# Altium schematic sheet 0215_BBR-0 - RE-TIMER -.SchDoc
size A3
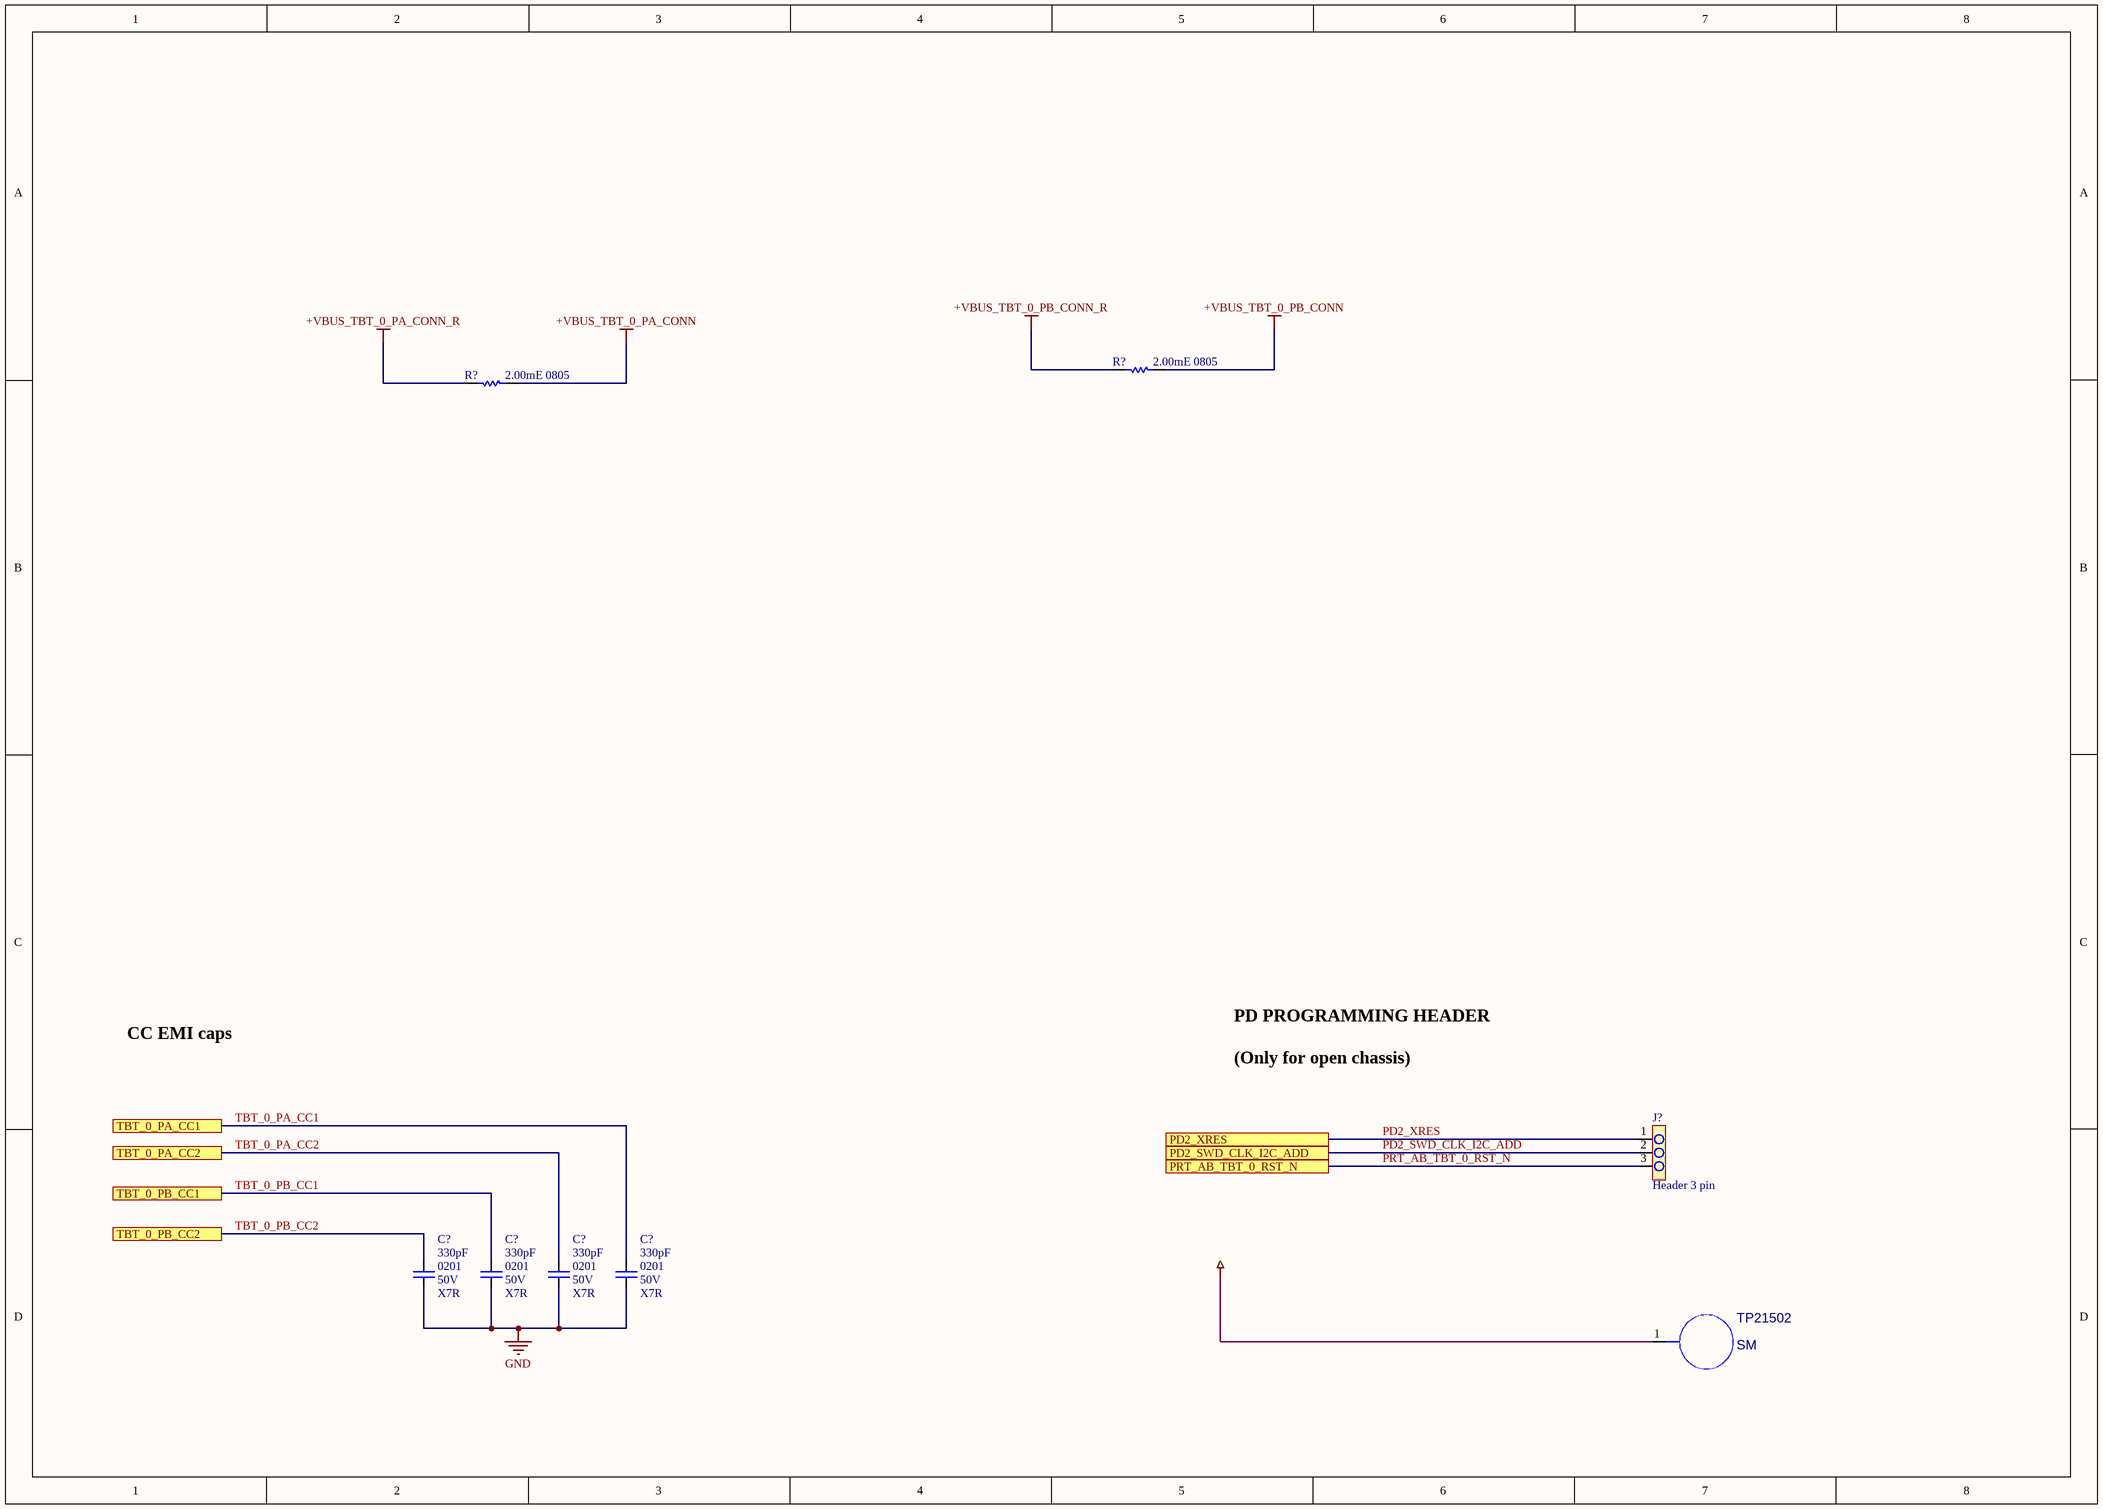
[diagram p0: 0215_BBR-0 - RE-TIMER -.SchDoc]

## Parts
(Parts that share a designator on the sheet are numbered #1, #2 ... from top to bottom, then left to right.)
C?#1  value 330pF  Case/Package: 0201  Voltage: 50V  Dielectric: X7R  [CAPC0201]
C?#2  value 330pF  Case/Package: 0201  Voltage: 50V  Dielectric: X7R  [CAPC0201]
C?#3  value 330pF  Case/Package: 0201  Voltage: 50V  Dielectric: X7R  [CAPC0201]
C?#4  value 330pF  Case/Package: 0201  Voltage: 50V  Dielectric: X7R  [CAPC0201]
J?  Header 3 pin
R?#1  value 2.00mE  Case/Package: 0805  [RESC0805]  (hidden comment: Res)
R?#2  value 2.00mE  Case/Package: 0805  [RESC0805]  (hidden comment: Res)
TP21502  PACK_TYPE: SM  [TPC30IA]  (hidden comment: TP)

## Ports
PD2_SWD_CLK_I2C_ADD, PD2_XRES, PRT_AB_TBT_0_RST_N, TBT_0_PA_CC1, TBT_0_PA_CC2, TBT_0_PB_CC1, TBT_0_PB_CC2

## Nets
+V3P3A_VDDD_PD2: TP21502.1(TP)
+VBUS_TBT_0_PA_CONN: R?#2.2
+VBUS_TBT_0_PA_CONN_R: R?#2.1
+VBUS_TBT_0_PB_CONN: R?#1.2
+VBUS_TBT_0_PB_CONN_R: R?#1.1
GND: C?#1.1 C?#2.1 C?#3.1 C?#4.1
PD2_SWD_CLK_I2C_ADD: J?.2 ; port PD2_SWD_CLK_I2C_ADD
PD2_XRES: J?.1 ; port PD2_XRES
PRT_AB_TBT_0_RST_N: J?.3 ; port PRT_AB_TBT_0_RST_N
TBT_0_PA_CC1: C?#4.2 ; port TBT_0_PA_CC1
TBT_0_PA_CC2: C?#3.2 ; port TBT_0_PA_CC2
TBT_0_PB_CC1: C?#2.2 ; port TBT_0_PB_CC1
TBT_0_PB_CC2: C?#1.2 ; port TBT_0_PB_CC2

## Notes on the sheet
- CC EMI caps
- PD PROGRAMMING HEADER
- (Only for open chassis)

## Library data of the parts
C?#1-C?#4 = Cap: CAP CER 330pF 50V X7R 0201
R?#1 R?#2 = Res: Thick Film Resistor -  2.00mohm, 1%,0805
TP21502 = TP#2: PART_NUMBER: NA_63939; CDS_PHYS_PART_NAME: TP_SM-NA_63939,EMPTY,TPC30IA,LPDB,GENERIC; CDS_LMAN_SYM_OUTLINE: -50,50,50,-50; OriginalSymbolOrigin: (-75,50); XY: (-350,575); VER: 1; ROT: 0; PHYS_PAGE: 215; LOCATION: TP21502; IP: GENERIC; FP_TECH: LPDB; DRAWING: @RVP1_ADL_SB_ADP_S_DDR5_SODIMM_2DPC_LIB.H55_DG2_2DPC(SCH_1):PAGE584; CDS_LIB: board_artifacts; MATERIAL: EMPTY; PCB Footprint: TPC30IA; CHIPS_PART_NAME: TP; CDS_PART_NAME: TP_SM-NA_63939,EMPTY,TPC30IA,LPDB,GENERIC; CDS_LOCATION: TP21502